# Altium schematic sheet Power_3V3.SchDoc
size A4; Organization: TESLA Motors, INC; Address1: 3500 Deer Creek Road; Address2: Palo Alto, CA; Address4: U.S.A.; SheetNumber: 5; SheetTotal: 10
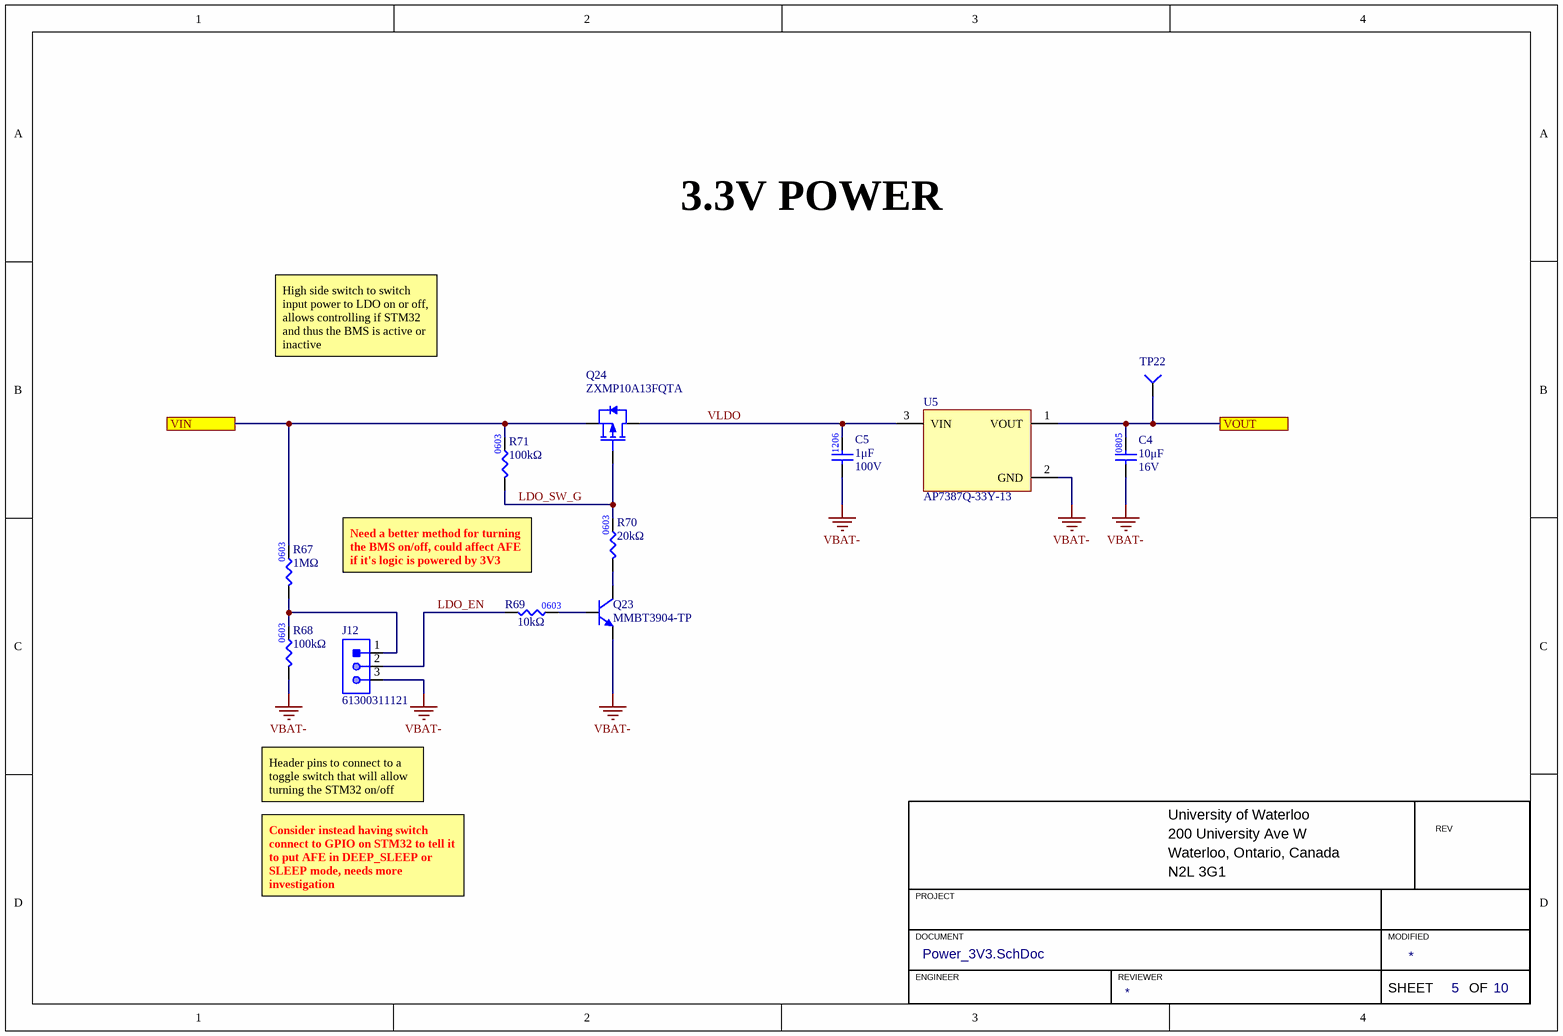
[diagram p0: Power_3V3.SchDoc]

## Parts
C4  value 10μF  Voltage Rating: 16V  [CAP2012]  (hidden comment: CAP_10uF_16V_0805)
C5  value 1μF  Voltage Rating: 100V  [CAPC3216X190X50NL20T25]  (hidden comment: CAP_1uF_100V_1206)
J12  Manufacturer Part Number 1: 61300311121  [HDR1X3]  (hidden comment: HEADER 3x1)
Q23  Manufacturer Part Number 1: MMBT3904-TP  [SOT23-3]  (hidden comment: NPN_40V_100mA)
Q24  Manufacturer Part Number 1: ZXMP10A13FQTA  [SOT23-3]  (hidden comment: PMOS_100V_600mA)
R67  value 1MΩ  [RES0603]  (hidden comment: RES_1MΩ_0603_1%)
R68  value 100kΩ  [RES0603]  (hidden comment: RES_100kΩ_0603_1%)
R69  value 10kΩ  [RES0603]  (hidden comment: RES_10kΩ_0603_1%)
R70  value 20kΩ  [RES0603]  (hidden comment: RES_20kΩ_0603_1%)
R71  value 100kΩ  [RES0603]  (hidden comment: RES_100kΩ_0603_1%)
TP22  TESTPOINT_SMD_LOOP  [S1751-46R]  (value not drawn)
U5  Manufacturer Part Number 1: AP7387Q-33Y-13  [SOT89]  (hidden comment: LDO_3.3V_150mA_60VIN)

## Ports
VIN, VOUT

## Nets
VBAT-: C4.1 C5.1 J12.3 Q23.2(E) R68.1 U5.2(GND)
LDO_EN: J12.2 R69.1
LDO_SW_G: Q24.1(Gate) R70.2 R71.1
VIN: Q24.2(Source) R67.2 R71.2 ; port VIN
VLDO: C5.2 Q24.3(Drain) U5.3(VIN)
VOUT: C4.2 TP22.1(=value) U5.1(VOUT) ; port VOUT
NetJ12_1: J12.1 R67.1 R68.2
NetQ23_1: Q23.1(B) R69.2
NetQ23_3: Q23.3(C) R70.1

## Notes on the sheet
- 3.3V POWER
- High side switch to switch input power to LDO on or off, allows controlling if STM32 and thus the BMS is active or inactive
- Need a better method for turning the BMS on/off, could affect AFE if it's logic is powered by 3V3
- Header pins to connect to a toggle switch that will allow turning the STM32 on/off
- University of Waterloo
- 200 University Ave W
- REV
- Consider instead having switch connect to GPIO on STM32 to tell it to put AFE in DEEP_SLEEP or SLEEP mode, needs more investigation
- PROJECT
- Waterloo, Ontario, Canada
- N2L 3G1
- DOCUMENT
- ENGINEER
- REVIEWER
- MODIFIED
- SHEET
- OF
- (in symbol RES_20kΩ_0603_1%) 0603
- (in symbol RES_100kΩ_0603_1%) 0603

## Library data of the parts
C4 = CAP_10uF_16V_0805: CAP CER 10UF 16V X5R 0805; Manufacturer 1: Yageo; Manufacturer Part Number 1: CC0805KKX5R7BB106; Package/Footprint: 0805; Mounting Type: SMD; Supplier 1: Digi-Key; Supplier Part Number 1: 311-1865-1-ND; Dielectric: X5R
C5 = CAP_1uF_100V_1206: CAP CER 1UF 100V X7R 1206; Supplier 1: Digi-Key; Mounting Type: SMD; Package: 1206; Supplier Part Number 1: 490-16468-1-ND
J12 = HEADER 3x1: CONN HEADER VERT 3POS 2.54MM; Manufacturer 1: Würth Elektronik; Supplier 1: Digi-Key; Mounting Type: TH; Pitch: 2.54mm; Supplier Part Number 1: 732-5316-ND
Q23 = NPN_40V_100mA: TRANS NPN 40V 0.2A SOT23; Manufacturer 1: Micro Commercial Co; Package: SOT-23-3; Supplier Part Number 1: MMBT3904TPMSCT-ND; Supplier 1: Digi-Key
Q24 = PMOS_100V_600mA: MOSFET P-CH 100V 600MA SOT23; Manufacturer 1: Diodes Incorporated; Package/Footprint: SOT-23-3; Supplier Part Number 1: ZXMP10A13FQTADICT-ND; Supplier 1: Digi-Key; Mounting Type: SMD
R67 = RES_1MΩ_0603_1%: RES 1M OHM 1% 1/10W 0603; Manufacturer 1: YAGEO; Manufacturer Part Number 1: RC0603FR-071ML; Supplier Part Number 1: 311-1.00MHRCT-ND; Supplier 1: Digi-Key; Mounting Type: SMD; Package: 0603
R68 R71 = RES_100kΩ_0603_1%: RES 100K OHM 1% 1/10W 0603; Manufacturer 1: Yageo; Manufacturer Part Number 1: RC0603FR-07100KL; Supplier Part Number 1: 311-100KHRCT-ND; Supplier 1: Digi-Key
R69 = RES_10kΩ_0603_1%: RES 10K OHM 1% 1/8W 0603; Manufacturer 1: Stackpole Electronics Inc; Manufacturer Part Number 1: RNCP0603FTD10K0; Supplier Part Number 1: RNCP0603FTD10K0CT-ND; Supplier 1: Digi-Key; Mounting Type: SMD; Package: 0603
R70 = RES_20kΩ_0603_1%: RES 20K OHM 1% 1/10W 0603; Manufacturer 1: Yageo; Manufacturer Part Number 1: RC0603FR-0720KL; Supplier Part Number 1: 311-20.0KHRCT-ND; Supplier 1: Digi-Key
TP22 = TESTPOINT_SMD_LOOP: TESTPOINT SMD LOOP; Manufacturer 1: Harwin; Supplier 1: Digi-Key; Manufacturer Part Number 1: S1751-46R; Mounting Type: SMD; Package/Footprint: SMD; Supplier Part Number 1: 952-1478-1-ND
U5 = LDO_3.3V_150mA_60VIN: IC REG LINEAR 3.3V 150MA SOT89-3; Manufacturer 1: Diodes Incorporated; Current Output: 150mA; Supplier Part Number 1: 31-AP7387Q-33Y-13CT-ND; Supplier 1: Digi-Key